# EAGLE design extension.board.v2 (EAGLE 9.4.0)
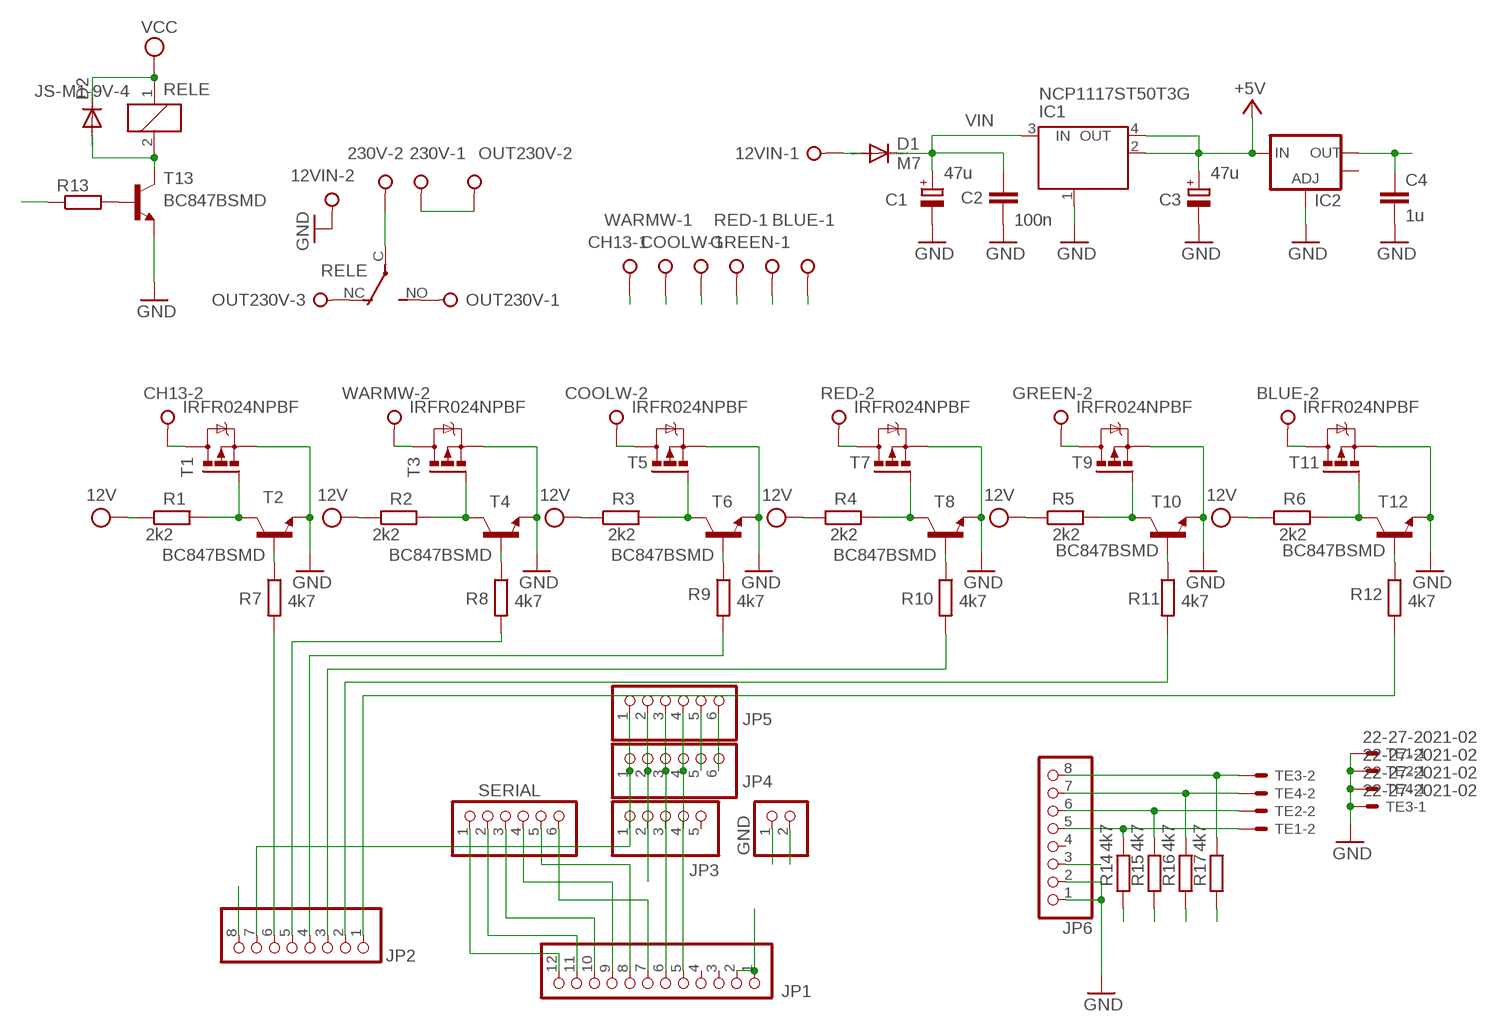
[diagram p0: schematic, sheet 1]

## Parts
12VIN  W237-02P  [W237-132]
230V  W237-02P  [W237-132]
BLUE  W237-02P  [W237-132]
C1  47u  CPOL-EUD  [PANASONIC_D]
C2  100n  C-EUC1206  [C1206]
C3  47u  CPOL-EUD  [PANASONIC_D]
C4  1u  C-EUC0805  [C0805]
CH13  W237-02P  [W237-132]
COOLW  W237-02P  [W237-132]
D1  M7  DIODE-SMB  [SMB]
D2  DIODE-DO-214AC  [DO-214AC]
GND  PINHD-1X2  [1X02]
GREEN  W237-02P  [W237-132]
IC1  NCP1117ST50T3G  MC33269ST-3.3T3  [SOT223]
IC2  V_REG_LM1117SOT223  [SOT223]
JP1  PINHD-1X12  [1X12]
JP2  PINHD-1X8  [1X08]
JP3  PINHD-1X5  [1X05]
JP4  PINHD-1X6  [1X06]
JP5  PINHD-1X6  [1X06]
JP6  PINHD-1X8  [1X08]
OUT230V  W237-3E  [W237-3E]
R1  2k2  R-EU_R1206  [R1206]
R2  2k2  R-EU_R1206  [R1206]
R3  2k2  R-EU_R1206  [R1206]
R4  2k2  R-EU_R1206  [R1206]
R5  2k2  R-EU_R1206  [R1206]
R6  2k2  R-EU_R1206  [R1206]
R7  4k7  R-EU_R1206  [R1206]
R8  4k7  R-EU_R1206  [R1206]
R9  4k7  R-EU_R1206  [R1206]
R10  4k7  R-EU_R1206  [R1206]
R11  4k7  R-EU_R1206  [R1206]
R12  4k7  R-EU_R1206  [R1206]
R13  R-EU_0207/15  [0207/15]
R14  4k7  R-EU_R1206  [R1206]
R15  4k7  R-EU_R1206  [R1206]
R16  4k7  R-EU_R1206  [R1206]
R17  4k7  R-EU_R1206  [R1206]
RED  W237-02P  [W237-132]
RELE  JS-M1-9V-4  [JS-M]
SERIAL  PINHD-1X6  [1X06]
T1  IRFR024NPBF  IRFR5305  [D-PAK_TO252AA]
T2  BC847BSMD  [SOT23]
T3  IRFR024NPBF  IRFR5305  [D-PAK_TO252AA]
T4  BC847BSMD  [SOT23]
T5  IRFR024NPBF  IRFR5305  [D-PAK_TO252AA]
T6  BC847BSMD  [SOT23]
T7  IRFR024NPBF  IRFR5305  [D-PAK_TO252AA]
T8  BC847BSMD  [SOT23]
T9  IRFR024NPBF  IRFR5305  [D-PAK_TO252AA]
T10  BC847BSMD  [SOT23]
T11  IRFR024NPBF  IRFR5305  [D-PAK_TO252AA]
T12  BC847BSMD  [SOT23]
T13  BC847BSMD  [SOT23]
TE1  22-27-2021-02  [6410-02]
TE2  22-27-2021-02  [6410-02]
TE3  22-27-2021-02  [6410-02]
TE4  22-27-2021-02  [6410-02]
WARMW  W237-02P  [W237-132]

## Nets
3.3V: C4.1 IC2.2(OUT) JP2.8 JP3.2 JP4.2 JP5.2 R14.2 R15.2 R16.2 R17.2
+5V [power usb]: C3.+ D2.C GND.2 IC1.2(OUT) IC1.4(OUT) IC2.3(IN) JP1.1 JP1.2 RELE.1 ; supply symbol labelled VCC
GND: 12VIN.2 C1.- C2.2 C3.- C4.2 GND.1 IC1.1(GND/ADJ) IC2.1(ADJ) JP2.7 JP3.1 JP4.1 JP5.1 JP6.1 JP6.2 T1.3(S) T2.2(E) T3.3(S) T4.2(E) T5.3(S) T6.2(E) T7.3(S) T8.2(E) T9.3(S) T10.2(E) T11.3(S) T12.2(E) T13.2(E) TE1.1 TE2.1 TE3.1 TE4.1
N$1: 230V.1 OUT230V.2
N$2: 230V.2 RELE.C(2:P)
N$3: JP1.7 SERIAL.6
N$4: JP1.8 SERIAL.5
N$5: JP2.1 R12.2
N$6: JP2.2 R11.2
N$7: JP2.3 R10.2
N$8: JP2.4 R9.2
N$9: JP2.5 R8.2
N$10: JP2.6 R7.2
N$11: R7.1 T2.1(B)
N$12: R1.2 T1.1(G) T2.3(C)
N$13: CH13.2 T1.4(D)
N$14: OUT230V.1 RELE.NO(2:S)
N$15: R8.1 T4.1(B)
N$16: R2.2 T3.1(G) T4.3(C)
N$17: T3.4(D) WARMW.2
N$18: R9.1 T6.1(B)
N$19: R3.2 T5.1(G) T6.3(C)
N$20: COOLW.2 T5.4(D)
N$21: R10.1 T8.1(B)
N$22: R4.2 T7.1(G) T8.3(C)
N$23: JP1.9 SERIAL.4
N$24: JP1.10 SERIAL.3
N$25: JP1.11 SERIAL.2
N$26: JP6.8 R17.1 TE3.2
N$27: RED.2 T7.4(D)
N$28: R11.1 T10.1(B)
N$29: R5.2 T9.1(G) T10.3(C)
N$30: GREEN.2 T9.4(D)
N$31: R12.1 T12.1(B)
N$32: R6.2 T11.1(G) T12.3(C)
N$33: BLUE.2 T11.4(D)
N$34: R13.2 T13.1(B)
N$37: OUT230V.3 RELE.NC(2:O)
N$39: JP6.7 R16.1 TE4.2
N$41: D2.A RELE.2 T13.3(C)
N$43: JP6.5 R14.1 TE1.2
N$45: JP6.6 R15.1 TE2.2
N$46: JP4.5 JP5.5
N$47: JP4.6 JP5.6
PWRIN [power]: 12VIN.1 BLUE.1 CH13.1 COOLW.1 D1.A GREEN.1 RED.1 WARMW.1
SCL: JP1.5 JP3.4 JP4.4 JP5.4
SDA: JP1.6 JP3.3 JP4.3 JP5.3
TX3: JP1.12 R13.1 SERIAL.1
VIN [power]: C1.+ C2.1 D1.C IC1.3(IN) JP6.3 R1.1 R2.1 R3.1 R4.1 R5.1 R6.1 ; supply symbol labelled 12V
Unconnected: IC2.4(OUT) JP1.3 JP1.4 JP3.5 JP6.4

## Library data of the parts
12VIN 230V BLUE CH13 COOLW GREEN RED WARMW = con-wago-508:W237-02P: WAGO SREW CLAMP; OC_FARNELL: unknown; OC_NEWARK: unknown
C1 C3 = rcl:CPOL-EU: POLARIZED CAPACITOR, European symbol
C2 C4 = rcl:C-EU: CAPACITOR, European symbol
D1 D2 = diode:DIODE-: DIODE
GND = pinhead:PINHD-1X2: PIN HEADER
IC1 = linear:MC33269ST*: Adjustable Output Low Dropout Voltage Regulator 800 mA Source: http://www.onsemi.com/pub/Collateral/MC33269-D.PDF
IC2 = sparkfun:V_REG_LM1117: Voltage Regulator LM1117 Standard adjustable voltage regulator but in SMD form. Spark Fun Electronics SKU : COM-00595
JP1 = pinhead:PINHD-1X12: PIN HEADER
JP2 JP6 = pinhead:PINHD-1X8: PIN HEADER
JP3 = pinhead:PINHD-1X5: PIN HEADER
JP4 JP5 SERIAL = pinhead:PINHD-1X6: PIN HEADER
OUT230V = con-wago-508:W237-3E: WAGO SREW CLAMP; OC_FARNELL: unknown; OC_NEWARK: unknown
R1-R17 = rcl:R-EU_: RESISTOR, European symbol
RELE = relay:JS-M1*: Automotive Ultra-Miniature Power Relay NAiS Source: http://www.mew-europe.com/.. en_ds_61211_0000.pdf; OC_FARNELL: unknown; OC_NEWARK: unknown
T1 T3 T5 T7 T9 T11 = transistor-power:IRF?5305: HEXFET Power MOSFET Source: http://www.irf.com/product-info/datasheets/data/irfr5305pbf.pdf
T2 T4 T6 T8 T10 T12 T13 = transistor-npn:BC847*: NPN Transistor
TE1-TE4 = con-molex:22-?-02: CONNECTOR wire to board 2.54 mm (.1 inch) pitch header; OC_FARNELL: unknown; OC_NEWARK: unknown

## Net classes
0 default: width 0.406 mm, drill 0.406 mm, clearance 0.406 mm
1 power: width 0.61 mm, drill 0.406 mm, clearance 0.203 mm
2 gnd: width 0.305 mm, drill 0.406 mm, clearance 0.203 mm
3 power usb: width 0.508 mm, drill 0.406 mm, clearance 0.203 mm

## Board
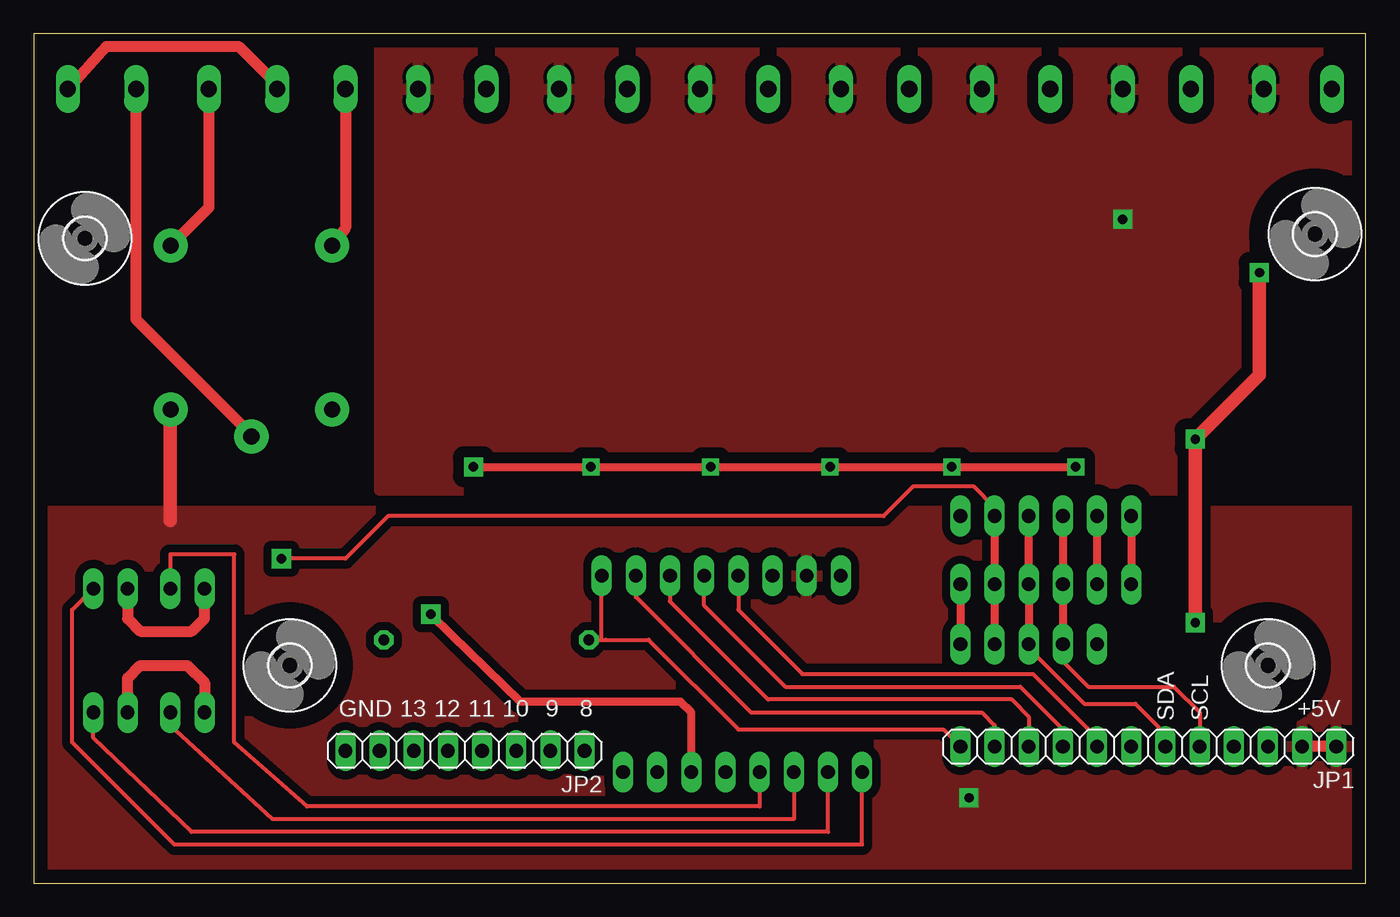
[diagram p1: board, top side]
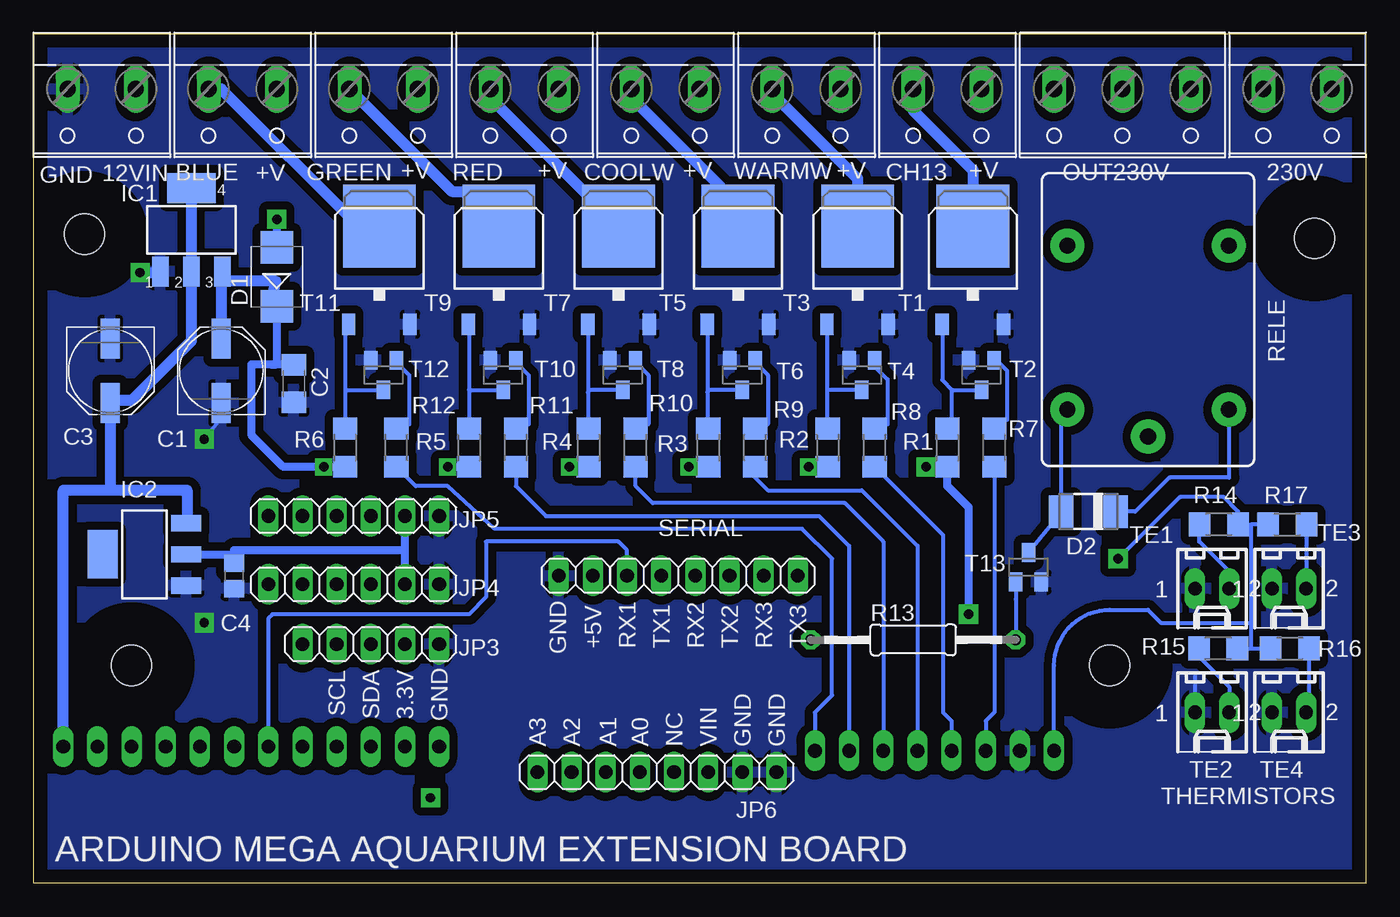
[diagram p2: board, bottom side, seen from below]

Size 99.04 x 63.17 mm. Coordinates in mm from the lower left corner, seen from the top.
Outline: 0,0 99.04,0 99.04,63.17 0,63.17 0,0
Copper layers (1*16): Top 0.035mm / dielectric 1.5mm / Bottom 0.035mm
Design rules "default": minimum track width 10mil, minimum drill 24mil, track to track 8mil, track to pad 8mil, pad to pad 8mil, via to via 8mil, smd to smd 8mil, copper to edge 40mil, drill to drill 8mil, minimum pad ring 10mil, minimum via ring 8mil, stop-mask expansion 4mil, vias tented up to drill 0mil, thermal gap 10mil

### Footprints (pad centres in the part's own frame; a part is rotated, then mirrored left to right if it is on the bottom)
W237-132 = drill 1.194 long: 1 -2.54,-0.635; 2 2.54,-0.635
PANASONIC_D = smd 3 x 1.4: + 2.4,0; - -2.4,0
C1206 = smd 1.6 x 1.8: 1 -1.4,0; 2 1.4,0
C0805 = smd 1.3 x 1.5: 1 -0.95,0; 2 0.95,0
SMB = smd 2.4 x 2.4: A 2.2,0; C -2.2,0
DO-214AC = smd 1.8 x 2.4: A 2.025,0; C -2.025,0
1X02 = drill 1.016 long: 1 -1.27,0; 2 1.27,0
SOT223 = smd 1.219 x 2.235: 1 -2.311,-3.099; 2 0,-3.099; 3 2.311,-3.099 | smd 3.6 x 2.2: 4 0,3.099
1X12 = drill 1.016 long: 1 -13.97,0; 2 -11.43,0; 3 -8.89,0; 4 -6.35,0; 5 -3.81,0; 6 -1.27,0; 7 1.27,0; 8 3.81,0; 9 6.35,0; 10 8.89,0; 11 11.43,0; 12 13.97,0
1X08 = drill 1.016 long: 1 -8.89,0; 2 -6.35,0; 3 -3.81,0; 4 -1.27,0; 5 1.27,0; 6 3.81,0; 7 6.35,0; 8 8.89,0
1X05 = drill 1.016 long: 1 -5.08,0; 2 -2.54,0; 3 0,0; 4 2.54,0; 5 5.08,0
1X06 = drill 1.016 long: 1 -6.35,0; 2 -3.81,0; 3 -1.27,0; 4 1.27,0; 5 3.81,0; 6 6.35,0
W237-3E = drill 1.194 long: 1 -5.08,-0.635; 2 0,-0.635; 3 5.08,-0.635
R1206 = smd 1.6 x 1.803: 1 -1.422,0; 2 1.422,0
0207/15 = drill 0.8 pad 1.422 octagon: 1 -7.62,0; 2 7.62,0
JS-M = drill 1.2 pad 2.54: 1 6.7,6; 2 6.7,-6; C 8.7,0; NC -5.5,-6; NO -5.5,6
D-PAK_TO252AA = smd 1 x 1.6: 1 -2.28,-4.8; 3 2.28,-4.8 | smd 5.4 x 6.2: 4 0,2.5
SOT23 = smd 1 x 1.4: 1 -0.95,-1.1; 2 0.95,-1.1; 3 0,1.1
6410-02 = drill 1.016 long: 1 1.27,0; 2 -1.27,0
3,0 = hole 3: 0,0

### Placement (x,y rotation side)
12VIN  93.98,58.42 180 bottom
230V  5.08,58.42 180 bottom
BLUE  83.5,58.42 180 bottom
C1  85.09,38.1 90 bottom
C2  79.69,37.15 270 bottom
C3  93.34,38.1 270 bottom
C4  84.14,22.86 270 bottom
CH13  31.12,58.42 180 bottom
COOLW  52.07,58.42 180 bottom
D1  80.96,45.09 90 bottom
D2  20.64,27.62 180 bottom
GND  58.74,22.86 0 bottom
GREEN  73.03,58.42 180 bottom
IC1  87.31,48.58 0 bottom
IC2  90.8,24.45 90 bottom
JP1  82.87,10.16 180 top
JP2  32.07,9.84 180 top
JP3  73.98,17.78 180 bottom
JP4  75.25,22.23 180 bottom
JP5  75.25,27.3 180 bottom
JP6  52.7,8.26 180 bottom
OUT230V  18.1,58.42 180 bottom
R1  31.12,32.38 90 bottom
R2  40,32.38 90 bottom
R3  48.89,32.38 90 bottom
R4  57.78,32.38 90 bottom
R5  66.67,32.38 90 bottom
R6  75.88,32.38 90 bottom
R7  27.62,32.38 270 bottom
R8  36.51,32.38 270 bottom
R9  45.4,32.38 270 bottom
R10  54.29,32.38 270 bottom
R11  63.18,32.38 270 bottom
R12  72.07,32.38 270 bottom
R13  33.66,18.1 0 bottom
R14  10.93,26.67 0 bottom
R15  10.98,17.46 0 bottom
R16  5.66,17.46 180 bottom
R17  5.85,26.67 180 bottom
RED  62.55,58.42 180 bottom
RELE  16.19,41.91 270 bottom
SERIAL  48.58,22.86 180 bottom
T1  29.21,46.35 0 bottom
T2  28.58,37.78 180 bottom
T3  37.78,46.35 0 bottom
T4  37.47,37.78 180 bottom
T5  46.67,46.35 0 bottom
T6  46.36,37.78 180 bottom
T7  55.56,46.35 0 bottom
T8  55.25,37.78 180 bottom
T9  64.45,46.35 0 bottom
T10  64.14,37.78 180 bottom
T11  73.34,46.35 0 bottom
T12  73.03,37.78 180 bottom
T13  25.08,23.5 0 bottom
TE1  11.43,21.91 180 bottom
TE2  11.43,12.7 180 bottom
TE3  5.71,21.91 180 bottom
TE4  5.71,12.7 180 bottom
U$1  [3,0]  95.25,48.26 0 top
U$2  [3,0]  3.81,47.94 0 top
U$3  [3,0]  19.05,16.19 0 top
U$4  [3,0]  91.76,16.19 0 top
WARMW  41.59,58.42 180 bottom

### Tracks (layer width: path | path; a pad name or v marks a point on that pad's centre or on a via)
3.3V  (via drill 0.7 pad 1.42)
  Top 0.305: v18.41,24.13 23.18,24.13 26.35,27.3 63.18,27.3 65.41,29.53 69.85,29.53 71.44,27.94
  Top 0.61: 71.44,27.94 JP5.2 JP4.2 JP3.2
  Bottom 0.305: JP2.8 23.18,16.19 arc90 19.05,20.32 16.19,20.32 15.24,19.37 8.57,19.37 | 8.57,17.46 R15.2 9.68,17.58 | 8.57,17.46 R16.2 | v18.41,24.13 13.83,28.71 10.58,28.71 9.51,27.64 R14.2 8.57,26.67 | 8.57,26.67 8.57,19.37 | 8.57,19.37 8.57,17.46 | R17.2 8.57,26.67
  Bottom 0.61: IC2.2 84.14,24.45 C4.1 84.14,24.77 71.44,24.77 | JP4.2 71.44,24.77 | 71.44,24.77 JP5.2
+5V  (via drill 0.7 pad 1.42)
  Top 0.813: JP1.1 JP1.2
  Top 1.016: RELE.1 10.16,35.18 10.16,26.99
  Bottom 0.305: 18.73,27.74 D2.C 17.14,27.62 14.61,30.16 10.16,30.16 10.19,30.2 RELE.1 10.19,35.27
  Bottom 0.813: 93.34,29.21 87.63,29.21 87.63,26.84 IC2.3 | 93.34,29.21 96.84,29.21 JP1.1 | IC1.4 IC1.2 87.31,40.32 91.76,35.88 92.85,35.88 C3.+ 93.34,29.21
  other vias: 69.53,6.35
  pour Top (isolate 0.61): 98.74,27.62 -1.27,27.62 -1.27,0 98.74,0
GND  (via drill 0.7 pad 1.42)
  Top 0.61: JP4.1 JP3.1
  Top 0.813: TE3.1 6.99,19.68 7.94,18.73 11.75,18.73 12.7,19.68 TE1.1 | TE4.1 6.99,15.24 7.94,16.19 11.43,16.19 12.7,14.92 TE2.1
  Top 1.016: v86.36,19.37 v86.36,33.02 91.12,37.78 v91.12,45.4
  Bottom 0.305: C1.- 85.09,34.61 v86.36,33.02 | 12.7,15.56 TE2.1
  Bottom 0.813: v91.12,45.4 89.7,45.4 IC1.1
  pour Bottom (isolate 0.61): -0.32,63.18 99.38,63.18 99.38,0 -0.32,0
N$1
  Top 0.813: 230V.1 5.4,62.23 15.24,62.23 17.46,60.01 OUT230V.2
N$2
  Top 0.813: RELE.C 16.19,33.34 7.62,41.91 230V.2
N$3
  Bottom 0.305: SERIAL.6 54.93,24.77 55.56,25.4 65.41,25.4 65.41,21.27 66.67,20 81.28,20 81.6,19.68 JP1.7
N$4
  Top 0.305: SERIAL.5 52.39,20.32 57.15,15.56 74.3,15.56 79.06,10.79 JP1.8
N$5
  Bottom 0.305: JP2.1 40.96,12.7 39.69,13.97 39.69,24.13 41.91,26.35 64.77,26.35 68.26,29.53 70.64,29.53 R12.2
N$6
  Bottom 0.305: R11.2 63.18,29.53 60.96,27.3 40.64,27.3 38.42,25.08 JP2.2
N$7
  Bottom 0.305: R10.2 54.29,29.53 53.02,28.26 38.73,28.26 35.88,25.4 JP2.3
N$8
  Bottom 0.305: R9.2 45.57,30.33 44.45,29.21 37.47,29.21 33.34,25.08 JP2.4
N$9
  Bottom 0.305: R8.2 31.43,25.88 31.43,12.7 30.8,12.07 JP2.5
N$10
  Bottom 0.305: 28.11,30.48 R7.2 | 28.26,30.33 28.11,30.48 | 28.11,30.48 27.62,30.48 27.62,12.7 28.26,12.07 JP2.6
N$11
  Bottom 0.305: T2.1 27.45,38.88 26.67,38.1 26.67,34.44 R7.1
N$12
  Bottom 0.305: 30.76,36.68 T2.3 | R1.2 30.63,33.34 arc-45 30.76,33.47 30.76,36.68 | T1.1 31.49,37.41 30.76,36.68
N$13
  Bottom 0.813: CH13.2 33.66,57.47 29.21,53.02 T1.4
N$14
  Top 0.813: OUT230V.1 13.02,50.23 RELE.NO
N$15
  Bottom 0.305: T4.1 36.34,38.56 36.34,38.25 35.56,37.47 35.56,34.12 R8.1
N$16
  Bottom 0.305: T3.1 40.06,36.83 | 40.06,36.83 40.06,33.43 R2.2 | T4.3 39.91,36.68 40.06,36.83
N$17
  Bottom 0.813: WARMW.2 44.13,58.74 37.78,52.39 T3.4
N$18
  Bottom 0.305: T6.1 45.41,38.74 44.45,37.78 44.45,34.12 R9.1
N$19
  Bottom 0.305: 48.99,41.59 T5.1 48.95,36.51 | 48.95,36.51 48.95,33.43 R3.2 | T6.3 48.78,36.68 48.95,36.51
N$20
  Bottom 0.813: T5.4 47.94,50.12 47.94,51.75 54.61,58.42 COOLW.2
N$21
  Bottom 0.305: T8.1 54.3,38.74 53.34,37.78 53.34,34.12 R10.1
N$22
  Bottom 0.305: 57.88,41.59 T7.1 57.84,36.51 | T8.3 57.67,36.68 57.84,36.51 | 57.84,36.51 57.84,33.87 R4.2
N$23
  Top 0.305: SERIAL.4 49.85,20.64 55.88,14.61 73.34,14.61 76.52,11.43 JP1.9
N$24
  Top 0.305: JP1.10 73.98,12.38 72.71,13.65 54.61,13.65 47.31,20.96 SERIAL.3
N$25
  Top 0.305: SERIAL.2 44.77,21.27 53.34,12.7 70.48,12.7 71.44,11.75 JP1.11
N$26
  Top 0.305: TE3.2 2.86,20.32 2.86,10.48 10.48,2.86 61.59,2.86 JP6.8
  Bottom 0.305: R17.1 4.43,21.93 TE3.2
N$27
  Bottom 0.813: RED.2 65.09,58.38 T7.4
N$28
  Bottom 0.305: T10.1 arc-45 62.83,38.42 62.83,38.38 62.23,37.78 62.23,34.12 R11.1
N$29
  Bottom 0.305: 66.67,36.68 T10.3 | T9.1 arc45 66.67,41.42 66.67,36.68 | 66.67,36.68 R5.2
N$30
  Bottom 0.813: GREEN.2 67.95,51.44 67.03,51.44 T9.4
N$31
  Bottom 0.305: T12.1 72.08,38.74 71.12,37.78 71.12,34.12 R12.1
N$32
  Bottom 0.305: 75.88,36.68 T12.3 | T11.1 75.7,41.48 arc-45 75.88,41.03 75.88,36.68 | 75.88,36.68 R6.2
N$33
  Bottom 0.813: BLUE.2 85.09,59.05 74.93,48.89 73.38,48.89 T11.4
N$34
  Bottom 0.305: T13.1 26.04,21.12 R13.2
N$37
  Top 0.813: OUT230V.3 23.18,48.71 RELE.NC
N$39
  Top 0.305: TE4.2 4.45,10.79 11.75,3.81 59.06,3.81 JP6.7
  Bottom 0.305: R16.1 4.24,12.9 TE4.2
N$41
  Bottom 0.305: T13.3 22.19,28.12 22.66,27.65 D2.A 22.66,34.74 RELE.2
N$43
  Top 0.305: TE1.2 10.16,24.45 14.92,24.45 14.92,10.48 20.32,5.71 53.97,5.71 53.97,6.03 JP6.5
  Bottom 0.305: R14.1 12.38,26.52 12.38,25.4 10.16,23.18 TE1.2
N$45
  Top 0.305: TE2.2 10.16,11.75 17.78,4.76 56.52,4.76 JP6.6
  Bottom 0.305: R15.1 12.22,17.3 12.22,16.66 10.16,14.61 TE2.2
N$46
  Top 0.61: JP5.5 JP4.5
N$47
  Top 0.61: JP5.6 JP4.6
PWRIN  (via drill 0.7 pad 1.42)
  Bottom 0.61: v80.96,49.37 D1.A
  pour Top (isolate 0.813): 25.72,62.87 99.06,62.87 99.06,29.21 25.72,29.21
SCL
  Top 0.305: JP3.4 76.52,16.51 78.42,14.61 84.77,14.61 86.68,12.7 JP1.5
  Top 0.61: JP5.4 JP4.4 JP3.4
SDA
  Top 0.305: JP3.3 73.98,17.46 78.11,13.34 81.92,13.34 84.14,11.11 JP1.6
  Top 0.61: JP5.3 JP4.3 JP3.3
TX3
  Top 0.305: JP1.12 67.63,11.43 52.39,11.43 45.72,18.1 42.55,18.1 42.23,18.1 | 42.23,18.1 SERIAL.1 | R13.1 42.23,18.1
VIN  (via drill 0.7 pad 1.27, 0.7 pad 1.42)
  Top 0.61: v32.7,30.96 v41.43,30.96 v50.32,30.96 v59.21,30.96 v68.26,30.96 v77.47,30.96 | JP6.3 48.89,12.7 48.1,13.49 36.2,13.49 31.12,18.41 v29.53,20
  Bottom 0.305: D1.C 80.96,42.67
  Bottom 0.61: C2.1 81.12,38.55 | 81.12,38.55 81.31,38.55 82.87,38.58 82.87,33.34 80.49,30.96 v77.47,30.96 R6.1 | R1.1 v32.7,30.96 | v41.43,30.96 40.01,30.96 R2.1 | v50.32,30.96 48.9,30.96 R3.1 | v59.21,30.96 57.79,30.96 R4.1 | v68.26,30.96 66.68,30.96 R5.1 | R1.1 | v29.53,20 29.53,27.94 31.12,29.53 R1.1 | 80.96,42.67 80.96,38.71 81.12,38.55
  Bottom 0.813: D1.C arc45 81.02,44.77 85.09,44.77 | IC1.3 arc-45 85.09,45.26 85.09,44.77 | 85.09,44.77 C1.+

### Text on the board
tNames: GND | 13 | 12 | 11 | 10 | 9 | 8 | +5V | SDA | SCL
bNames: +V | +V | +V | +V | +V | +V | GND | TX3 | RX3 | TX2 | RX2 | TX1 | RX1 | +5V | 3.3V | SDA | SCL | GND | GND | GND | VIN | NC | A0 | A1 | A2 | A3 | THERMISTORS | ARDUINO MEGA AQUARIUM EXTENSION BOARD